# Altium schematic sheet Sheet1.SchDoc
size A3
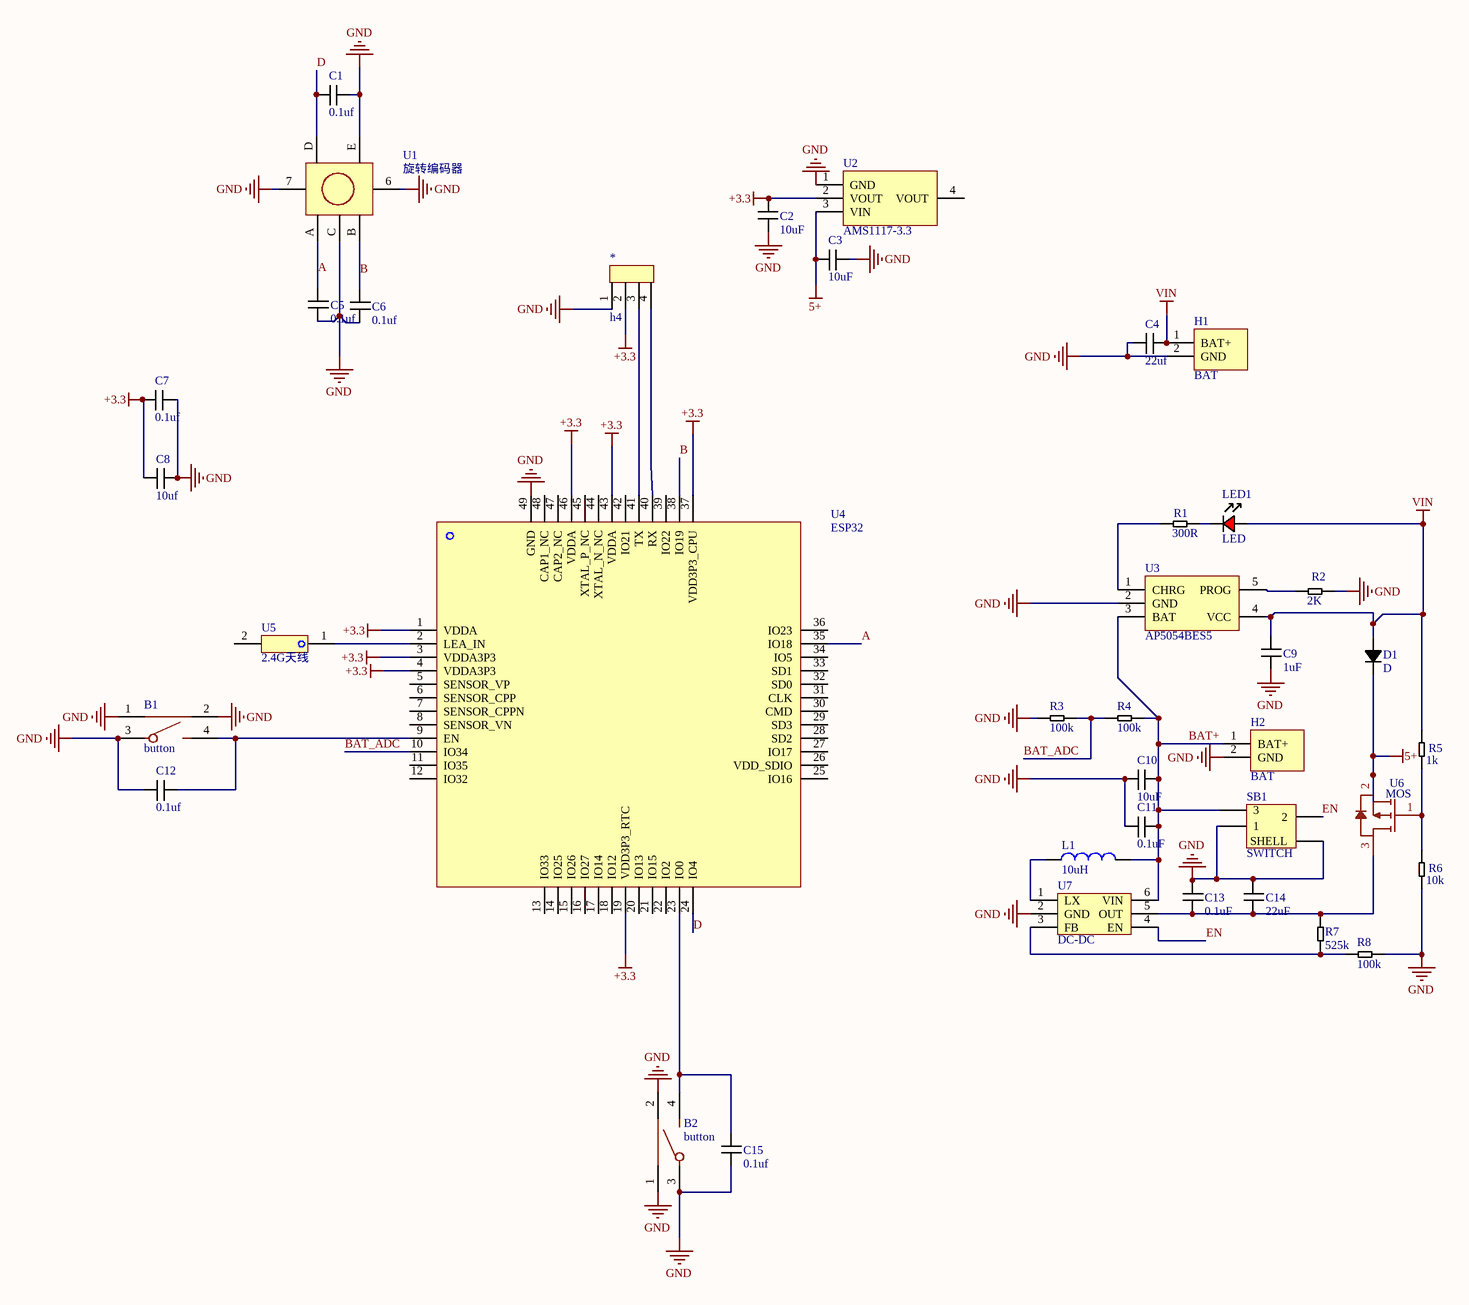
[diagram p0: Sheet1.SchDoc]

## Parts
*  h4  [pin4]
B1  button  [button]
B2  button  [button]
C1  0.1uf  [0805CAP]
C2  10uF  [0805CAP]
C3  10uF  [0805CAP]
C4  22uf  [0805CAP]
C5  0.1uf  [0805CAP]
C6  0.1uf  [0805CAP]
C7  0.1uf  [0805CAP]
C8  10uf  [0805CAP]
C9  1uF  [0805CAP]
C10  10uF  [0805CAP]
C11  0.1uF  [0805CAP]
C12  0.1uf  [0805CAP]
C13  0.1uF  [0805CAP]
C14  22uF  [0805CAP]
C15  0.1uf  [0805CAP]
D1  D  [1206D]
H1  BAT  [BAT]
H2  BAT  [BAT]
L1  10uH  [LND]
LED1  LED  [0805LED]
R1  300R  [0805R]
R2  2K  [0805R]
R3  100k  [0805R]
R4  100k  [0805R]
R5  1k  [0805R]
R6  10k  [0805R]
R7  525k  [0805R]
R8  100k  [0805R]
SB1  SWITCH  [SB]
U1  旋转编码器  [SW-TH_EC11XXXXXXXX]
U2  AMS1117-3.3  [AMS1117-3.3]
U3  AP5054BES5  [AP5054BES5]
U4  ESP32  [ESP32_PICO]
U5  2.4G天线  [2.4G天线]
U6  MOS  [PMOS]
U7  DC-DC  [FP6715S6CTR]

## Nets
5+: C3.1(SHELL) D1.2(-) U2.3(VIN) U6.2(S)
+3.3: *.2 C2.1(SHELL) C7.1(SHELL) C8.1(SHELL) U2.2(VOUT) U4.1(VDDA) U4.3(VDDA3P3) U4.4(VDDA3P3) U4.19(VDD3P3_RTC) U4.37(VDD3P3_CPU) U4.43(VDDA) U4.46(VDDA)
GND: *.1 B1.1(H) B1.2(H) B1.3(H) B2.1(H) B2.2(H) B2.3(H) C1.2(SHELL) C2.2(SHELL) C3.2(SHELL) C4.1(SHELL) C5.1(SHELL) C6.1(SHELL) C7.2(SHELL) C8.2(SHELL) C9.1(SHELL) C10.1(SHELL) C11.1(SHELL) C12.1(SHELL) C13.2(SHELL) C14.2(SHELL) C15.1(SHELL) H1.2(GND) H2.2(GND) R2.2 R3.1 R6.1 R8.1 SB1.1 SB1.4(SHELL) U1.6 U1.7 U1.C U1.E U2.1(GND) U3.2(GND) U4.49(GND) U7.2(GND)
VIN: C4.2(SHELL) C9.2(SHELL) D1.1(+) H1.1(BAT+) LED1.1(+) R5.2 U3.4(VCC)
A: C5.2(SHELL) U1.A U4.35(IO18)
B: C6.2(SHELL) U1.B U4.38(IO19)
BAT+: C10.2(SHELL) C11.2(SHELL) H2.1(BAT+) L1.2 R4.2 SB1.3 U3.3(BAT) U7.6(VIN)
BAT_ADC: R3.2 R4.1 U4.10(IO34)
D: C1.1(SHELL) U1.D U4.24(IO4)
EN: SB1.2 U7.4(EN)
Net*_3: *.3 U4.41(TX)
Net*_4: *.4 U4.40(RX)
NetB1_4: B1.4(H) C12.2(SHELL) U4.9(EN)
NetB2_4: B2.4(H) C15.2(SHELL) U4.23(IO0)
NetC13_1: C13.1(SHELL) C14.1(SHELL) R7.2 U6.3(D) U7.5(OUT)
NetL1_1: L1.1 U7.1(LX)
NetLED1_2: LED1.2(-) R1.2
NetR1_1: R1.1 U3.1(CHRG)
NetR2_1: R2.1 U3.5(PROG)
NetR5_1: R5.1 R6.2 U6.1(G)
NetR7_1: R7.1 R8.2 U7.3(FB)
NetU4_2: U4.2(LEA_IN) U5.1

Not connected (* = marked no-connect by the designer): U2 4(VOUT); U4 5(SENSOR_VP) 6(SENSOR_CPP) 7(SENSOR_CPPN) 8(SENSOR_VN) 11(IO35) 12(IO32) 13(IO33) 14(IO25) 15(IO26) 16(IO27) 17(IO14) 18(IO12) 20(IO13) 21(IO15) 22(IO2) 25(IO16) 26(VDD_SDIO) 27(IO17) 28(SD2) 29(SD3) 30(CMD) 31(CLK) 32(SD0) 33(SD1) 34(IO5) 36(IO23) 39(IO22) 42(IO21) 44(XTAL_N_NC) 45(XTAL_P_NC) 47(CAP2_NC) 48(CAP1_NC); U5 2

## Library data of the parts
C1-C15 = CAP
L1 = LND
R1-R8 = RES
U4 = ESP32-PICO-D4
U6 = PMOS
U7 = FP6715S6CTR